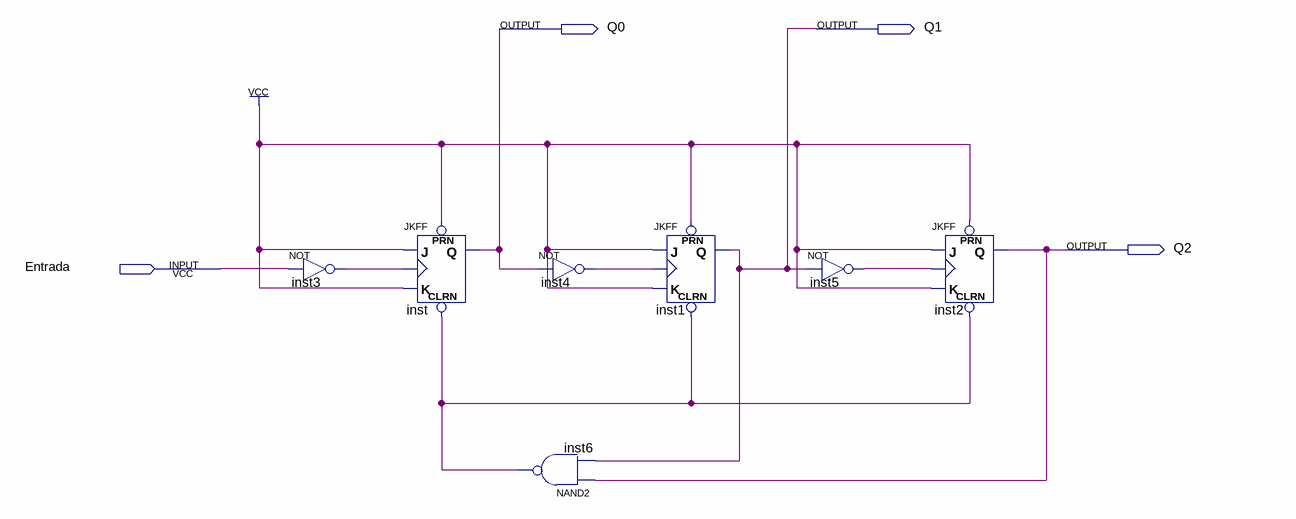
[diagram p0: schematic sheet]
// Quartus schematic Mod6.bdf as structural Verilog: 7 symbols, 4 pins
module Mod6 (
  input  Entrada,
  output Q0,
  output Q1,
  output Q2
);

  wire inst3_out, inst4_out, inst5_out, inst6_out;

  not inst3 (inst3_out, Entrada);
  JKFF inst (.PRN(1'b1), .CLRN(inst6_out), .K(1'b1), .J(1'b1), .CLK(inst3_out), .Q(Q0));
  nand inst6 (inst6_out, Q2, Q1);
  not inst4 (inst4_out, Q0);
  JKFF inst1 (.PRN(1'b1), .CLRN(inst6_out), .K(1'b1), .J(1'b1), .CLK(inst4_out), .Q(Q1));
  not inst5 (inst5_out, Q1);
  JKFF inst2 (.PRN(1'b1), .CLRN(inst6_out), .K(1'b1), .J(1'b1), .CLK(inst5_out), .Q(Q2));
endmodule
